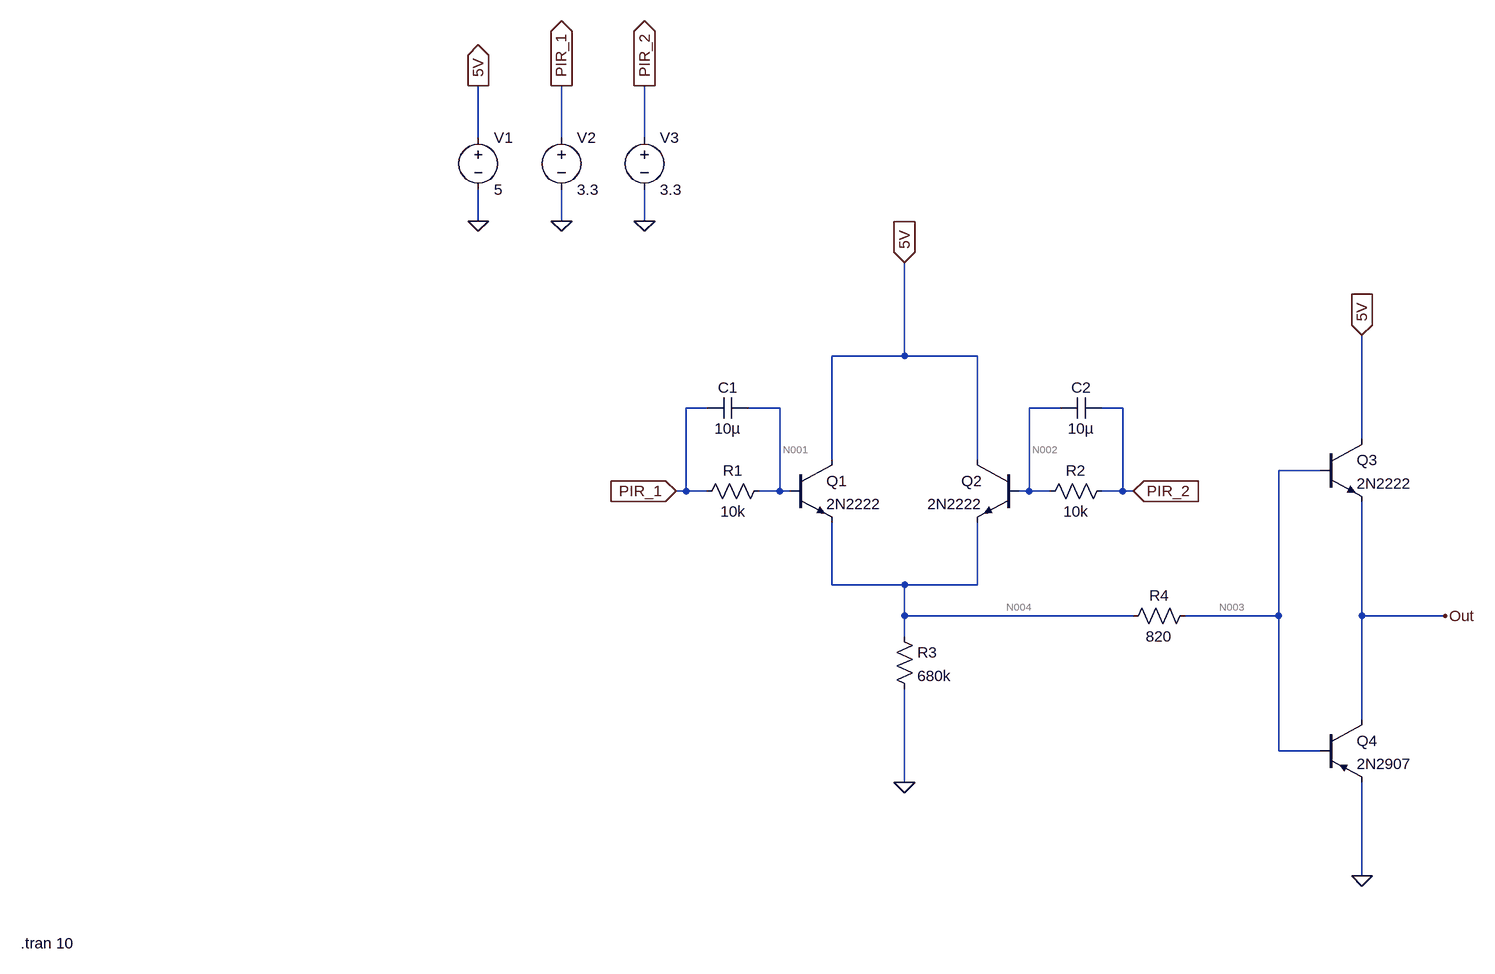
[diagram p0: schematic OR_gate_revision_3.asc]
OR_gate_revision_3.asc, the LTspice schematic file:
Version 4
SHEET 1 1892 824
WIRE 288 -432 288 -512
WIRE 416 -432 416 -512
WIRE 544 -432 544 -512
WIRE 288 -304 288 -352
WIRE 416 -304 416 -352
WIRE 544 -304 544 -352
WIRE 944 -96 944 -240
WIRE 944 -96 832 -96
WIRE 1056 -96 944 -96
WIRE 640 -16 608 -16
WIRE 752 -16 704 -16
WIRE 1184 -16 1136 -16
WIRE 1280 -16 1248 -16
WIRE 1648 32 1648 -128
WIRE 832 64 832 -96
WIRE 1056 64 1056 -96
WIRE 1584 80 1520 80
WIRE 608 112 608 -16
WIRE 608 112 592 112
WIRE 640 112 608 112
WIRE 752 112 752 -16
WIRE 752 112 720 112
WIRE 768 112 752 112
WIRE 1136 112 1136 -16
WIRE 1136 112 1120 112
WIRE 1168 112 1136 112
WIRE 1280 112 1280 -16
WIRE 1280 112 1248 112
WIRE 1296 112 1280 112
WIRE 832 256 832 160
WIRE 944 256 832 256
WIRE 1056 256 1056 160
WIRE 1056 256 944 256
WIRE 944 304 944 256
WIRE 1296 304 944 304
WIRE 1520 304 1520 80
WIRE 1520 304 1376 304
WIRE 1648 304 1648 128
WIRE 1776 304 1648 304
WIRE 944 336 944 304
WIRE 1648 464 1648 304
WIRE 1520 512 1520 304
WIRE 1584 512 1520 512
WIRE 944 560 944 416
WIRE 1648 704 1648 560
FLAG 288 -304 0
FLAG 288 -512 5V
IOPIN 288 -512 Out
FLAG 944 -240 5V
IOPIN 944 -240 In
FLAG 592 112 PIR_1
IOPIN 592 112 In
FLAG 1296 112 PIR_2
IOPIN 1296 112 In
FLAG 416 -304 0
FLAG 416 -512 PIR_1
IOPIN 416 -512 Out
FLAG 544 -304 0
FLAG 544 -512 PIR_2
IOPIN 544 -512 Out
FLAG 944 560 0
FLAG 1648 -128 5V
IOPIN 1648 -128 In
FLAG 1648 704 0
FLAG 1776 304 Out
SYMBOL npn 768 64 R0
SYMATTR InstName Q1
SYMATTR Value 2N2222
SYMBOL npn 1120 64 M0
SYMATTR InstName Q2
SYMATTR Value 2N2222
SYMBOL res 736 96 R90
WINDOW 0 0 56 VBottom 2
WINDOW 3 32 56 VTop 2
SYMATTR InstName R1
SYMATTR Value 10k
SYMBOL res 1264 96 R90
WINDOW 0 0 56 VBottom 2
WINDOW 3 32 56 VTop 2
SYMATTR InstName R2
SYMATTR Value 10k
SYMBOL voltage 288 -448 R0
WINDOW 123 0 0 Left 0
WINDOW 39 0 0 Left 0
SYMATTR InstName V1
SYMATTR Value 5
SYMBOL res 928 320 R0
SYMATTR InstName R3
SYMATTR Value 680k
SYMBOL voltage 416 -448 R0
WINDOW 123 0 0 Left 0
WINDOW 39 0 0 Left 0
SYMATTR InstName V2
SYMATTR Value 3.3
SYMBOL voltage 544 -448 R0
WINDOW 123 0 0 Left 0
WINDOW 39 0 0 Left 0
SYMATTR InstName V3
SYMATTR Value 3.3
SYMBOL cap 704 -32 R90
WINDOW 0 0 32 VBottom 2
WINDOW 3 32 32 VTop 2
SYMATTR InstName C1
SYMATTR Value 10µ
SYMBOL cap 1248 -32 R90
WINDOW 0 0 32 VBottom 2
WINDOW 3 32 32 VTop 2
SYMATTR InstName C2
SYMATTR Value 10µ
SYMBOL res 1392 288 R90
WINDOW 0 0 56 VBottom 2
WINDOW 3 32 56 VTop 2
SYMATTR InstName R4
SYMATTR Value 820
SYMBOL npn 1584 32 R0
SYMATTR InstName Q3
SYMATTR Value 2N2222
SYMBOL pnp 1584 464 R0
SYMATTR InstName Q4
SYMATTR Value 2N2907
TEXT -416 808 Left 2 !.tran 10

The netlist it stands for:
* OR_gate_revision_3.asc
Q1 5V N001 N004 0 2N2222
Q2 5V N002 N004 0 2N2222
R1 N001 PIR_1 10k
R2 PIR_2 N002 10k
V1 5V 0 5
R3 N004 0 680k
V2 PIR_1 0 3.3
V3 PIR_2 0 3.3
C1 N001 PIR_1 10µ
C2 PIR_2 N002 10µ
R4 N003 N004 820
Q3 5V N003 Out 0 2N2222
Q4 Out N003 0 0 2N2907
.model NPN NPN
.model PNP PNP
.lib standard.bjt
.tran 10
.backanno
.end

* Results of the author's LTspice run, read from the files saved beside the schematic
* Operating Point, zero values left out:
*   V(5v) = 5 V
*   V(n001) = 3.3 V
*   V(n004) = 2.805 V
*   V(n002) = 3.3 V
*   V(pir_1) = 3.3 V
*   V(pir_2) = 3.3 V
*   V(n003) = 2.805 V
*   V(out) = 2.805 V
*   Ib(Q4) = 2.805 pA
*   Ie(Q4) = -2.815 pA
*   Ic(Q3) = 2.209 pA
*   Ib(Q3) = -2.198 pA
*   Ic(Q2) = 2.053 µA
*   Ib(Q2) = 10.09 nA
*   Ie(Q2) = -2.063 µA
*   Ic(Q1) = 2.053 µA
*   Ib(Q1) = 10.09 nA
*   Ie(Q1) = -2.063 µA
*   I(R3) = 4.125 µA
*   I(R2) = 10.09 nA
*   I(R1) = -10.09 nA
*   I(V3) = -10.09 nA
*   I(V2) = -10.09 nA
*   I(V1) = -4.105 µA